# EAGLE schematic EnguinoShieldSchematic (EAGLE 8.3.1)

## Sheet 1 of 2
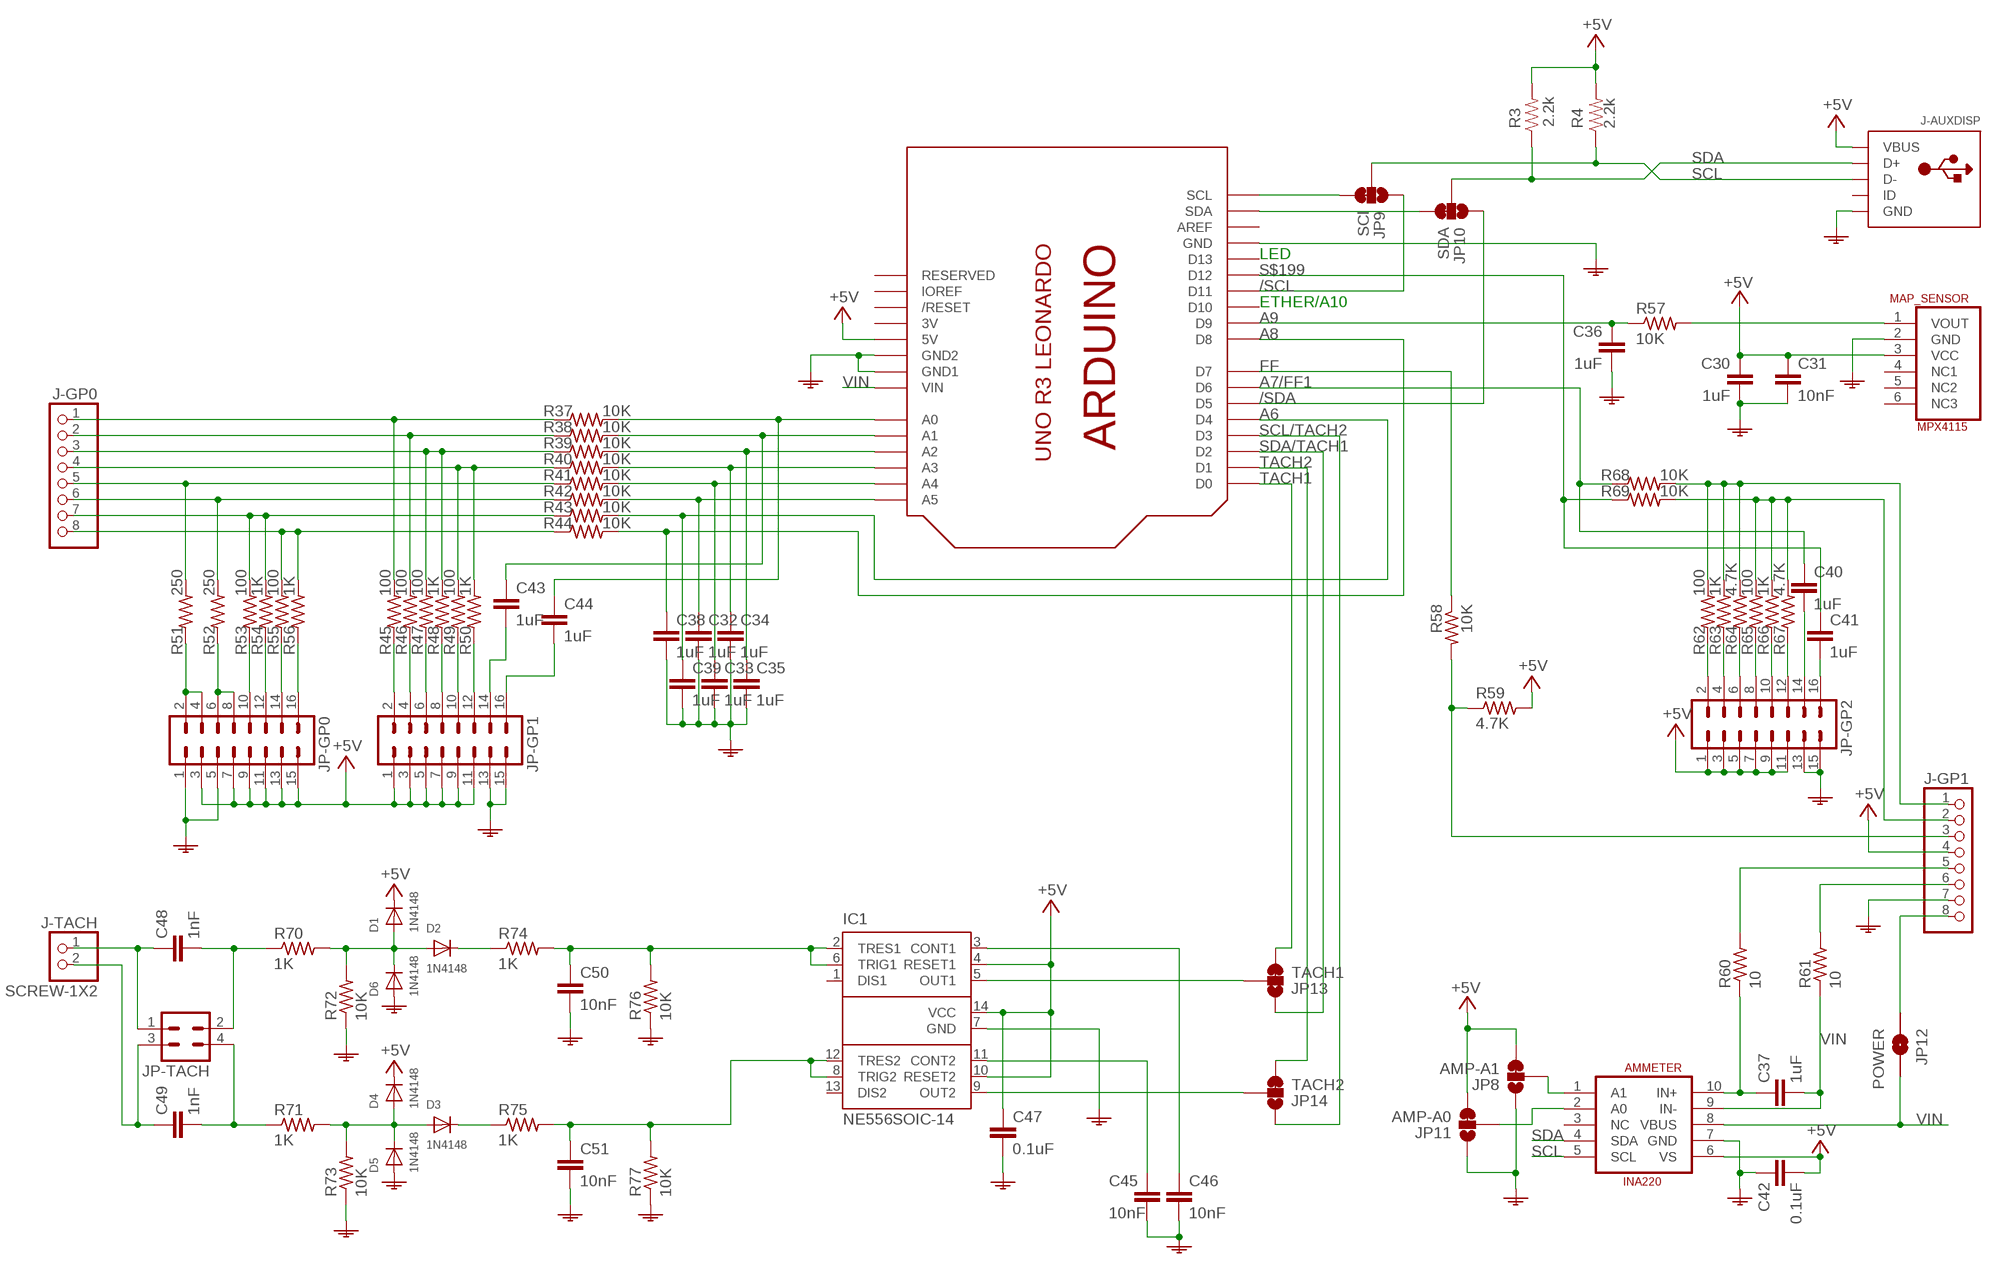
[diagram p0: schematic, sheet 1]

### Parts
AMMETER  INA220  [VSSOP-10]
C30  1uF  CAP-1UF10V  [0603]
C31  10nF  CAP-10NF  [0603]
C32  1uF  CAP-1UF10V  [0603]
C33  1uF  CAP-1UF10V  [0603]
C34  1uF  CAP-1UF10V  [0603]
C35  1uF  CAP-1UF10V  [0603]
C36  1uF  CAP-1UF10V  [0603]
C37  1uF  CAP-1UF10V  [0603]
C38  1uF  CAP-1UF10V  [0603]
C39  1uF  CAP-1UF10V  [0603]
C40  1uF  CAP-1UF10V  [0603]
C41  1uF  CAP-1UF10V  [0603]
C42  0.1uF  CAP-0.1UF10V  [0603]
C43  1uF  CAP-1UF10V  [0603]
C44  1uF  CAP-1UF10V  [0603]
C45  10nF  CAP-10NF  [0603]
C46  10nF  CAP-10NF  [0603]
C47  0.1uF  CAP-0.1UF10V  [0603]
C48  1nF  CAP-1NF  [0603]
C49  1nF  CAP-1NF  [0603]
C50  10nF  CAP-10NF  [0603]
C51  10nF  CAP-10NF  [0603]
D1  1N4148  DIODESOD-123  [SOD-123]
D2  1N4148  DIODESOD-123  [SOD-123]
D3  1N4148  DIODESOD-123  [SOD-123]
D4  1N4148  DIODESOD-123  [SOD-123]
D5  1N4148  DIODESOD-123  [SOD-123]
D6  1N4148  DIODESOD-123  [SOD-123]
IC1  NE556SOIC-14  [SO14]
J-AUXDISP  USB-B-MICRO  [MICRO-USB-AMPHERNOL]
J-GP0  SCREW-1X8BIG  [1X08-BIG]
J-GP1  SCREW-1X8BIG  [1X08-BIG]
J-TACH  SCREW-1X2  [1X02-BIG]
JP8  AMP-A1  JUMPER-SMT_3-NC_NO-SILK  [SMT-JUMPER_3_NC]
JP9  SCl  JUMPER-SMT_3-NC_NO-SILK  [SMT-JUMPER_3_NC]
JP10  SDA  JUMPER-SMT_3-NC_NO-SILK  [SMT-JUMPER_3_NC]
JP11  AMP-A0  JUMPER-SMT_3-NC_NO-SILK  [SMT-JUMPER_3_NC]
JP12  POWER  JUMPER-SMT_2_NO_SILK  [SMT-JUMPER_2_NO]
JP13  TACH1  JUMPER-SMT_3-NC_NO-SILK  [SMT-JUMPER_3_NC]
JP14  TACH2  JUMPER-SMT_3-NC_NO-SILK  [SMT-JUMPER_3_NC]
JP-GP0  MA08-2  [MA08-2]
JP-GP1  MA08-2  [MA08-2]
JP-GP2  MA08-2  [MA08-2]
JP-TACH  MA02-2  [MA02-2]
MAP_SENSOR  MPX4115  [MPX4115-AP]
R3  2.2k  2.2KOHM-0603-1/10W-1%  [0603]
R4  2.2k  2.2KOHM-0603-1/10W-1%  [0603]
R37  10K  R-US_R0603  [R0603]
R38  10K  R-US_R0603  [R0603]
R39  10K  R-US_R0603  [R0603]
R40  10K  R-US_R0603  [R0603]
R41  10K  R-US_R0603  [R0603]
R42  10K  R-US_R0603  [R0603]
R43  10K  R-US_R0603  [R0603]
R44  10K  R-US_R0603  [R0603]
R45  100  R-US_R0603  [R0603]
R46  100  R-US_R0603  [R0603]
R47  100  R-US_R0603  [R0603]
R48  1K  R-US_R0603  [R0603]
R49  100  R-US_R0603  [R0603]
R50  1K  R-US_R0603  [R0603]
R51  250  R-US_R0603  [R0603]
R52  250  R-US_R0603  [R0603]
R53  100  R-US_R0603  [R0603]
R54  1K  R-US_R0603  [R0603]
R55  100  R-US_R0603  [R0603]
R56  1K  R-US_R0603  [R0603]
R57  10K  R-US_R0603  [R0603]
R58  10K  R-US_R0603  [R0603]
R59  4.7K  R-US_R0603  [R0603]
R60  10  R-US_R0603  [R0603]
R61  10  R-US_R0603  [R0603]
R62  100  R-US_R0603  [R0603]
R63  1K  R-US_R0603  [R0603]
R64  4.7K  R-US_R0603  [R0603]
R65  100  R-US_R0603  [R0603]
R66  1K  R-US_R0603  [R0603]
R67  4.7K  R-US_R0603  [R0603]
R68  10K  R-US_R0603  [R0603]
R69  10K  R-US_R0603  [R0603]
R70  1K  R-US_R0603  [R0603]
R71  1K  R-US_R0603  [R0603]
R72  10K  R-US_R0603  [R0603]
R73  10K  R-US_R0603  [R0603]
R74  1K  R-US_R0603  [R0603]
R75  1K  R-US_R0603  [R0603]
R76  10K  R-US_R0603  [R0603]
R77  10K  R-US_R0603  [R0603]
U1  ARDUINOR3LEO-DIMENSION  [ARDUINOR3]

### Nets
0V: AMMETER.7(GND) C30.2 C31.2 C32.2 C33.2 C34.2 C35.2 C36.2 C38.2 C39.2 C42.1 C45.2 C46.2 C47.2 C50.2 C51.2 D5.A D6.A IC1.7(GND) J-AUXDISP.P$5(GND) J-GP1.7 JP8.1 JP11.1 JP-GP0.1 JP-GP0.5 JP-GP1.13 JP-GP1.15 JP-GP2.13 JP-GP2.15 MAP_SENSOR.2(GND) R72.1 R73.1 R76.1 R77.1 U1.GND U1.GND1 U1.GND2 ; also sheet 2
+5V: AMMETER.6(VS) C30.1 C31.1 C42.2 C47.1 D1.C D4.C IC1.4(RESET1) IC1.10(RESET2) IC1.14(VCC) J-AUXDISP.P$1(VBUS) J-GP1.4 JP8.3 JP11.3 JP-GP0.3 JP-GP0.7 JP-GP0.9 JP-GP0.11 JP-GP0.13 JP-GP0.15 JP-GP1.1 JP-GP1.3 JP-GP1.5 JP-GP1.7 JP-GP1.9 JP-GP1.11 JP-GP2.1 JP-GP2.3 JP-GP2.5 JP-GP2.7 JP-GP2.9 JP-GP2.11 MAP_SENSOR.3(VCC) R3.2 R4.2 R59.2 U1.5V ; also sheet 2
/SCL: JP9.1 U1.D11
/SDA: JP10.1 U1.D5
A6: C39.1 R43.2 U1.D4
A7/FF1: C40.1 R68.1 U1.D6
A8: C38.1 R44.2 U1.D8
A9: C36.1 R57.1 U1.D9
FF: R58.1 U1.D7
JP7: C49.1 J-TACH.2 JP-TACH.3
N$40: J-GP0.7 R43.1 R53.2 R54.2
N$41: J-GP0.1 R37.1 R45.2
N$42: J-GP0.2 R38.1 R46.2
N$43: C44.1 R37.2 U1.A0
N$44: C43.2 JP-GP1.14
N$45: C35.1 R39.2 U1.A2
N$46: C34.1 R40.2 U1.A3
N$47: C33.1 R41.2 U1.A4
N$48: C32.1 R42.2 U1.A5
N$49: J-GP0.3 R39.1 R47.2 R48.2
N$50: J-GP0.4 R40.1 R49.2 R50.2
N$51: J-GP0.5 R41.1 R51.2
N$52: J-GP0.6 R42.1 R52.2
N$53: J-GP0.8 R44.1 R55.2 R56.2
N$54: C43.1 R38.2 U1.A1
N$55: C44.2 JP-GP1.16
N$56: JP-GP0.2 JP-GP0.4 R51.1
N$57: JP-GP1.2 R45.1
N$58: JP-GP1.4 R46.1
N$59: JP-GP1.6 R47.1
N$60: JP-GP1.8 R48.1
N$61: JP-GP1.10 R49.1
N$62: JP-GP1.12 R50.1
N$63: JP-GP0.6 JP-GP0.8 R52.1
N$64: JP9.3 U1.SCL
N$65: JP-GP0.16 R56.1
N$66: JP-GP0.14 R55.1
N$67: JP-GP0.12 R54.1
N$68: JP-GP0.10 R53.1
N$69: MAP_SENSOR.1(VOUT) R57.2
N$70: J-GP1.2 R65.2 R66.2 R67.2 R69.2
N$71: J-GP1.1 R62.2 R63.2 R64.2 R68.2
N$72: JP10.3 U1.SDA
N$73: J-GP1.3 R58.2 R59.1
N$74: AMMETER.9(IN-) C37.2 R61.1
N$75: AMMETER.10(IN+) C37.1 R60.1
N$76: J-GP1.5 R60.2
N$79: JP-GP2.2 R62.1
N$80: AMMETER.1(A1) JP8.2
N$81: AMMETER.2(A0) JP11.2
N$82: JP-GP2.4 R63.1
N$83: JP-GP2.6 R64.1
N$84: JP-GP2.8 R65.1
N$85: JP-GP2.10 R66.1
N$86: JP-GP2.12 R67.1
N$87: IC1.9(OUT2) JP14.2
N$88: C40.2 JP-GP2.14
N$89: IC1.5(OUT1) JP13.2
N$90: C41.2 JP-GP2.16
N$91: C50.1 IC1.2(TRES1) IC1.6(TRIG1) R74.2 R76.2
N$92: C45.1 IC1.11(CONT2)
N$93: C51.1 IC1.8(TRIG2) IC1.12(TRES2) R75.2 R77.2
N$94: C46.1 IC1.3(CONT1)
N$95: C48.1 J-TACH.1 JP-TACH.1
N$96: J-GP1.6 R61.2
N$97: C48.2 JP-TACH.2 R70.1
N$98: C49.2 JP-TACH.4 R71.1
N$99: D1.A D2.A D6.C R70.2 R72.2
N$100: D3.A D4.A D5.C R71.2 R73.2
N$101: D2.C R74.1
N$102: D3.C R75.1
S$199: C41.1 R69.1 U1.D12
SCL: AMMETER.5(SCL) J-AUXDISP.P$2(D-) JP9.2 R4.1 ; also sheet 2
SCL/TACH2: JP14.1 U1.D3
SDA: AMMETER.4(SDA) J-AUXDISP.P$3(D+) JP10.2 R3.1 ; also sheet 2
SDA/TACH1: JP13.1 U1.D2
TACH1: JP13.3 U1.D0
TACH2: JP14.3 U1.D1
VIN: AMMETER.8(VBUS) J-GP1.8 JP12.1 JP12.2 U1.VIN
Unconnected: AMMETER.3(NC) IC1.1(DIS1) IC1.13(DIS2) J-AUXDISP.P$4(ID) MAP_SENSOR.4(NC1) MAP_SENSOR.5(NC2) MAP_SENSOR.6(NC3) U1.AREF U1.D10 U1.D13 U1.IOREF U1.RESERVED U1.RESET(/RESET)

### Notes on the sheet
- LED
- ETHER/A10

## Sheet 2 of 2
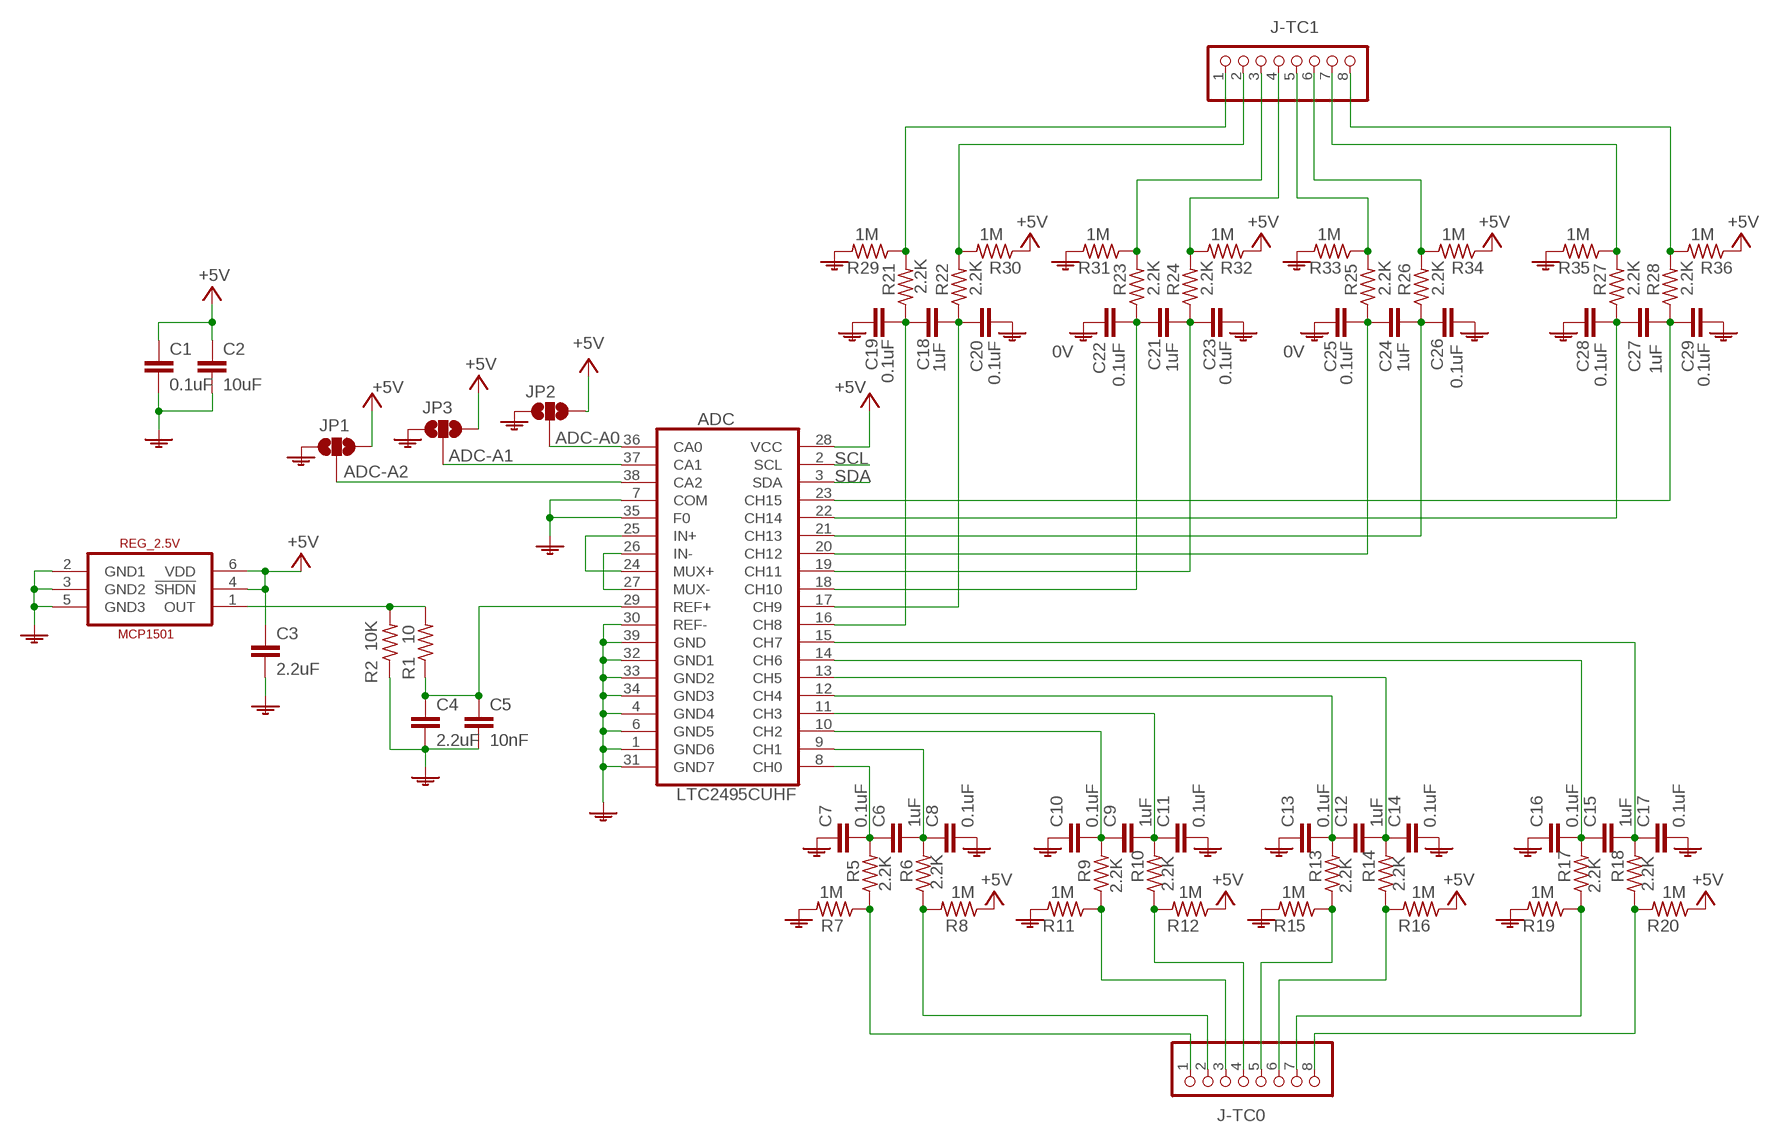
[diagram p1: schematic, sheet 2]

### Parts
ADC  LTC2495CUHF  [QFN-38]
C1  0.1uF  CAP-0.1UF10V  [0603]
C2  10uF  CAP-10UF10V  [0603]
C3  2.2uF  CAP-2.2UF10V  [0603]
C4  2.2uF  CAP-2.2UF10V  [0603]
C5  10nF  CAP-10NF  [0603]
C6  1uF  CAP-1UF10V  [0603]
C7  0.1uF  CAP-0.1UF10V  [0603]
C8  0.1uF  CAP-0.1UF10V  [0603]
C9  1uF  CAP-1UF10V  [0603]
C10  0.1uF  CAP-0.1UF10V  [0603]
C11  0.1uF  CAP-0.1UF10V  [0603]
C12  1uF  CAP-1UF10V  [0603]
C13  0.1uF  CAP-0.1UF10V  [0603]
C14  0.1uF  CAP-0.1UF10V  [0603]
C15  1uF  CAP-1UF10V  [0603]
C16  0.1uF  CAP-0.1UF10V  [0603]
C17  0.1uF  CAP-0.1UF10V  [0603]
C18  1uF  CAP-1UF10V  [0603]
C19  0.1uF  CAP-0.1UF10V  [0603]
C20  0.1uF  CAP-0.1UF10V  [0603]
C21  1uF  CAP-1UF10V  [0603]
C22  0.1uF  CAP-0.1UF10V  [0603]
C23  0.1uF  CAP-0.1UF10V  [0603]
C24  1uF  CAP-1UF10V  [0603]
C25  0.1uF  CAP-0.1UF10V  [0603]
C26  0.1uF  CAP-0.1UF10V  [0603]
C27  1uF  CAP-1UF10V  [0603]
C28  0.1uF  CAP-0.1UF10V  [0603]
C29  0.1uF  CAP-0.1UF10V  [0603]
J-TC0  SCREW-1X8BIG  [1X08-BIG]
J-TC1  SCREW-1X8BIG  [1X08-BIG]
JP1  ADC-A2  JUMPER-SMT_3_NO_NO-SILK  [SMT-JUMPER_3_NO]
JP2  ADC-A0  JUMPER-SMT_3_NO_NO-SILK  [SMT-JUMPER_3_NO]
JP3  ADC-A1  JUMPER-SMT_3_NO_NO-SILK  [SMT-JUMPER_3_NO]
R1  10  R-US_R0603  [R0603]
R2  10K  R-US_R0603  [R0603]
R5  2.2K  R-US_R0603  [R0603]
R6  2.2K  R-US_R0603  [R0603]
R7  1M  R-US_R0603  [R0603]
R8  1M  R-US_R0603  [R0603]
R9  2.2K  R-US_R0603  [R0603]
R10  2.2K  R-US_R0603  [R0603]
R11  1M  R-US_R0603  [R0603]
R12  1M  R-US_R0603  [R0603]
R13  2.2K  R-US_R0603  [R0603]
R14  2.2K  R-US_R0603  [R0603]
R15  1M  R-US_R0603  [R0603]
R16  1M  R-US_R0603  [R0603]
R17  2.2K  R-US_R0603  [R0603]
R18  2.2K  R-US_R0603  [R0603]
R19  1M  R-US_R0603  [R0603]
R20  1M  R-US_R0603  [R0603]
R21  2.2K  R-US_R0603  [R0603]
R22  2.2K  R-US_R0603  [R0603]
R23  2.2K  R-US_R0603  [R0603]
R24  2.2K  R-US_R0603  [R0603]
R25  2.2K  R-US_R0603  [R0603]
R26  2.2K  R-US_R0603  [R0603]
R27  2.2K  R-US_R0603  [R0603]
R28  2.2K  R-US_R0603  [R0603]
R29  1M  R-US_R0603  [R0603]
R30  1M  R-US_R0603  [R0603]
R31  1M  R-US_R0603  [R0603]
R32  1M  R-US_R0603  [R0603]
R33  1M  R-US_R0603  [R0603]
R34  1M  R-US_R0603  [R0603]
R35  1M  R-US_R0603  [R0603]
R36  1M  R-US_R0603  [R0603]
REG_2.5V  MCP1501  [SOT23-6]

### Nets
0V: ADC.1(GND6) ADC.4(GND4) ADC.6(GND5) ADC.7(COM) ADC.30(REF-) ADC.31(GND7) ADC.32(GND1) ADC.33(GND2) ADC.34(GND3) ADC.35(F0) ADC.39(GND) C1.2 C2.2 C3.2 C4.2 C5.2 C7.1 C8.2 C10.1 C11.2 C13.1 C14.2 C16.1 C17.2 C19.1 C20.2 C22.1 C23.2 C25.1 C26.2 C28.1 C29.2 JP1.1 JP2.1 JP3.1 R2.1 R7.2 R11.2 R15.2 R19.2 R29.2 R31.2 R33.2 R35.2 REG_2.5V.2(GND1) REG_2.5V.3(GND2) REG_2.5V.5(GND3) ; also sheet 1
+5V: ADC.28(VCC) C1.1 C2.1 C3.1 JP1.3 JP2.3 JP3.3 R8.1 R12.1 R16.1 R20.1 R30.1 R32.1 R34.1 R36.1 REG_2.5V.4(!SHDN) REG_2.5V.6(VDD) ; also sheet 1
N$1: ADC.26(IN-) ADC.27(MUX-)
N$2: ADC.24(MUX+) ADC.25(IN+)
N$3: ADC.38(CA2) JP1.2
N$4: ADC.37(CA1) JP3.2
N$5: ADC.36(CA0) JP2.2
N$6: ADC.8(CH0) C6.1 C7.2 R5.2
N$7: R1.2 R2.2 REG_2.5V.1(OUT)
N$8: ADC.9(CH1) C6.2 C8.1 R6.2
N$9: J-TC0.2 R6.1 R8.2
N$10: ADC.29(REF+) C4.1 C5.1 R1.1
N$11: J-TC0.1 R5.1 R7.1
N$12: ADC.12(CH4) C12.1 C13.2 R13.2
N$13: ADC.10(CH2) C9.1 C10.2 R9.2
N$14: ADC.11(CH3) C9.2 C11.1 R10.2
N$15: J-TC0.4 R10.1 R12.2
N$16: J-TC0.3 R9.1 R11.1
N$17: ADC.13(CH5) C12.2 C14.1 R14.2
N$18: J-TC0.6 R14.1 R16.2
N$19: J-TC0.5 R13.1 R15.1
N$20: ADC.14(CH6) C15.1 C16.2 R17.2
N$21: ADC.15(CH7) C15.2 C17.1 R18.2
N$22: J-TC0.8 R18.1 R20.2
N$23: J-TC0.7 R17.1 R19.1
N$24: ADC.16(CH8) C18.1 C19.2 R21.1
N$25: ADC.17(CH9) C18.2 C20.1 R22.1
N$26: ADC.18(CH10) C21.1 C22.2 R23.1
N$27: ADC.19(CH11) C21.2 C23.1 R24.1
N$28: ADC.20(CH12) C24.1 C25.2 R25.1
N$29: ADC.21(CH13) C24.2 C26.1 R26.1
N$30: ADC.22(CH14) C27.1 C28.2 R27.1
N$31: ADC.23(CH15) C27.2 C29.1 R28.1
N$32: J-TC1.1 R21.2 R29.1
N$33: J-TC1.2 R22.2 R30.2
N$34: J-TC1.3 R23.2 R31.1
N$35: J-TC1.4 R24.2 R32.2
N$36: J-TC1.5 R25.2 R33.1
N$37: J-TC1.6 R26.2 R34.2
N$38: J-TC1.7 R27.2 R35.1
N$39: J-TC1.8 R28.2 R36.2
SCL: ADC.2(SCL) ; also sheet 1
SDA: ADC.3(SDA) ; also sheet 1

## Power pins joined to a net without a drawn wire
3V: U1.3V

## Library data of the parts
ADC = 1Library:LTC2495CUHF: 8/16 16 bit ADC
AMMETER = 1Library:INA220
C1 C7 C8 C10 C11 C13 C14 C16 C17 C19 C20 C22 C23 C25 C26 C28 C29 C42 C47 = 1Library:CAP-0.1UF: 0.1µF ceramic capacitors A capacitor is a passive two-terminal electrical component used to store electrical energy temporarily in an electric field.
C2 = 1Library:CAP-10UF: 10µF ceramic capacitors A capacitor is a passive two-terminal electrical component used to store electrical energy temporarily in an electric field.
C3 C4 = 1Library:CAP-2.2UF: 2.2µF ceramic capacitors A capacitor is a passive two-terminal electrical component used to store electrical energy temporarily in an electric field.
C5 C31 C45 C46 C50 C51 = 1Library:CAP-10NF: 10NF ceramic capacitors A capacitor is a passive two-terminal electrical component used to store electrical energy temporarily in an electric field.
C6 C9 C12 C15 C18 C21 C24 C27 C30 C32-C41 C43 C44 = 1Library:CAP-1UF: 1µF ceramic capacitors A capacitor is a passive two-terminal electrical component used to store electrical energy temporarily in an electric field.
C48 C49 = 1Library:CAP-1NF: 1NF ceramic capacitors A capacitor is a passive two-terminal electrical component used to store electrical energy temporarily in an electric field.
D1-D6 = 1Library:DIODE: Diode SMADIODE - SMA Surface Mount Package 20V 1A Schottky Diode Digikey: 641-1014-6-ND DO-1N4148 - Through Hole Small Current Diode SOD-123 20V 1 A (.5mV Vf) Schottky Diode - Digikey: MBRX120TPMSCT-ND SOD-323 10V 570mA (.38mV Vf, 3ns) Schottky Diode - Digikey: ZLLS410CT-ND SOD-523 30V 30mA Schottky Diode (RB751S-40TE61) - Digikey: RB751S-40TE61CT-ND SOT23-R/W - SOT23 Package (R = Solder Paste/Reflow Ovens, W = Hand-Soldering) BAT54Film 40V 300mA - Digikey: 497-7162-1-ND
IC1 = 1Library:NE556: General Purpose Biopolartimer
J-AUXDISP = 1Library:USB-B-MICRO: USB B-MICRO Mounts on edge of board as shown in silk screen Should have oblong through holes! May not mount that great
J-GP0 J-GP1 J-TC0 J-TC1 = 1Library:SCREW-1X8: PIN HEADER
J-TACH = 1Library:SCREW-1X2
JP1-JP3 = 1Library:JUMPER-SMT_3_NO: Normally open jumper This jumper has three pads in close proximity to each other. Apply solder to close the connection(s).
JP8-JP11 JP13 JP14 = 1Library:JUMPER-SMT_3-NC: Normally closed trace jumper (1 of 2 connections) This jumper has a trace between two pads so it's normally closed (NC). The other connection is normally open (NO). Use a razor knife to open the connection. For best results follow the IPC guidelines for cutting traces: Cutout at least 0.063 mm (0.005 in). Remove all loose material to clean up the cut area. Seal the cut with an approved epoxy. Reapply solder to reclose the connection, or to close the NO connection.
JP12 = 1Library:JUMPER-SMT_2_NO: Normally open jumper This jumper has two pads in close proximity to each other. Apply solder to close the connection. Round pads are easier to solder for beginners, but are a lot larger. SparkFun Product that uses the round pads: SparkFun EL Sequencer <https://www.sparkfun.com/products/12781>
JP-GP0 JP-GP1 JP-GP2 = 1Library:MA08-2: PIN HEADER; OC_FARNELL: unknown; OC_NEWARK: unknown
JP-TACH = 1Library:MA02-2
MAP_SENSOR = 1Library:MPX4115
R1 R2 R5-R77 = 1Library:R-US_: RESISTOR, American symbol
R3 R4 = SparkFun-Resistors:2.2KOHM: 2.2kΩ resistor A resistor is a passive two-terminal electrical component that implements electrical resistance as a circuit element. Resistors act to reduce current flow, and, at the same time, act to lower voltage levels within circuits. - Wikipedia; PROD_ID: RES-08272
REG_2.5V = 1Library:MCP1501
U1 = 1Library:ARDUINOR3LEO: This is a new object for the new Arduino R3 - with extra pins that you may want to use (such as IOref, and duplicated A4/A5